# Altium schematic sheet Barridotemp.SchDoc
size A4; SheetNumber: 11; SheetTotal: 11
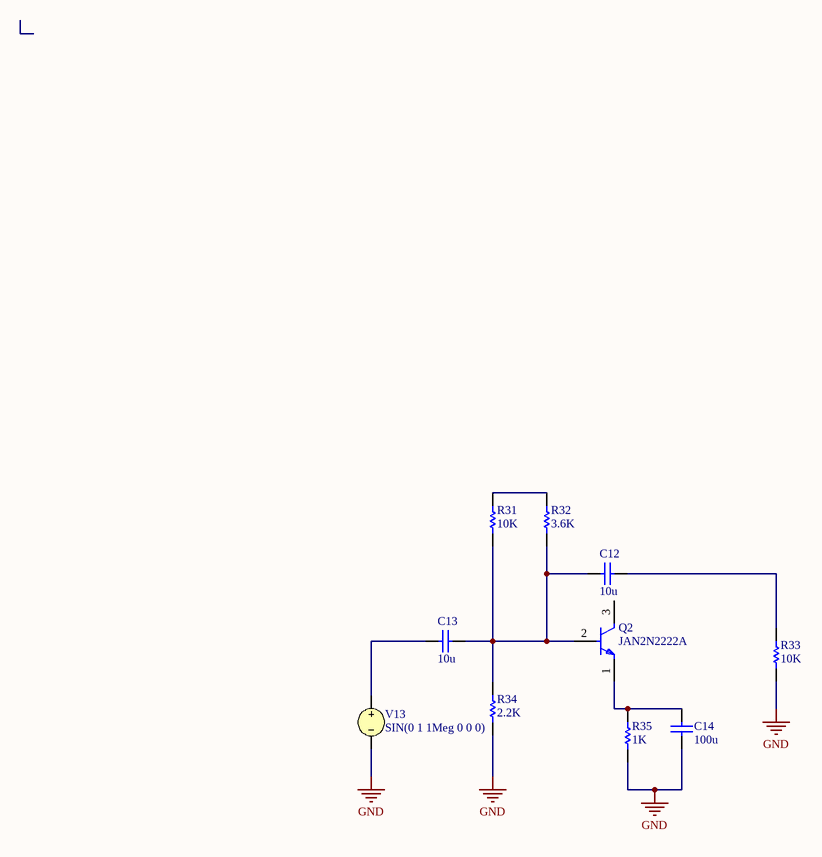
[diagram p0: Barridotemp.SchDoc]

## Parts
C12  value 10u  (hidden comment: Capacitor)
C13  value 10u  (hidden comment: Capacitor)
C14  value 100u  (hidden comment: Capacitor)
Q2  JAN2N2222A  [FP-JAN2N2222A-MFG]
R31  value 10K  (hidden comment: Resistor)
R32  value 3.6K  (hidden comment: Resistor)
R33  value 10K  (hidden comment: Resistor)
R34  value 2.2K  (hidden comment: Resistor)
R35  value 1K  (hidden comment: Resistor)
V13  SIN(0 1 1Meg 0 0 0)

## Nets
GND: C14.1 R33.1 R34.1 R35.1 V13.2
NetC12_1: C12.1 C13.2 Q2.2(B) R31.1 R32.1 R34.2
NetC12_2: C12.2 R33.2
NetC13_1: C13.1 V13.1
NetC14_2: C14.2 Q2.1(E) R35.2
NetR31_2: R31.2 R32.2

Not connected (* = marked no-connect by the designer): Q2 3(C)

## Library data of the parts
C12-C14 = Capacitor: SimulationGenericComponent: True
Q2 = CMP-06366-000013-1: TRANS NPN 50V 0.8A TO218
R31-R35 = Resistor: TC1: 0; SimulationGenericComponent: True; TC2: 0
V13 = VSRC: Voltage Source; Note: PCB Footprint - Not required; AC Magnitude: 1; AC Phase: 0; DC Magnitude: 5; Published: 8-Jun-2000; LatestRevisionDate: 17-Jul-2002; LatestRevisionNote: Re-released for DXP Platform.; PackageReference: Not Applicable; Publisher: Altium Limited; Offset: 0; Amplitude: 1; Frequency: 1Meg; Delay: 0; Damping Factor: 0; Phase: 0